# EAGLE design PowerLED_module (EAGLE 9.2.0)
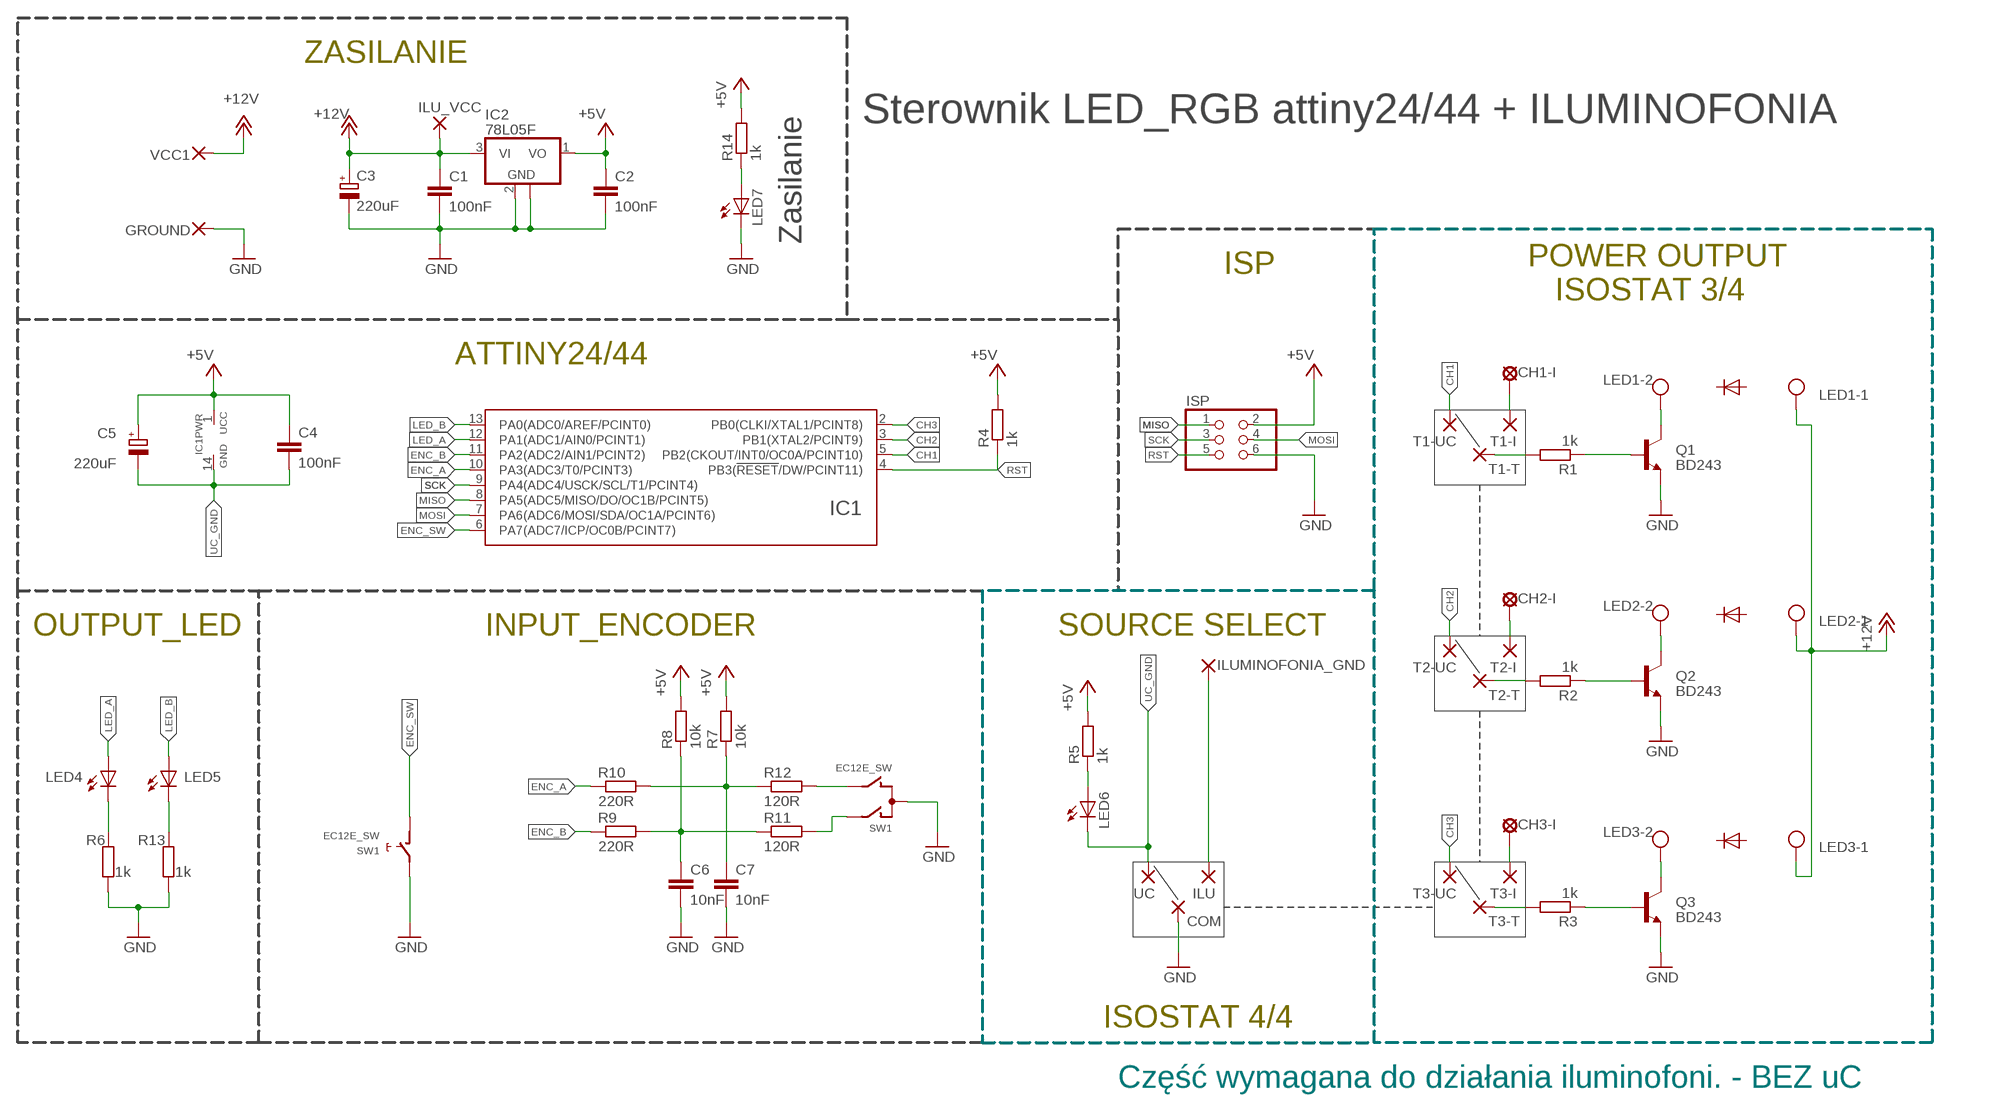
[diagram p0: schematic, sheet 1]

## Parts
C1  100nF  C-EU050-045-075  [C50-45-75]
C2  100nF  C-EU050-045-075  [C50-45-75]
C3  220uF  C-EU-POL'  [E2,5-6]
C4  100nF  C-EU050-045-075  [C50-45-75]
C5  220uF  C-EU-POL'  [E2,5-6]
C6  10nF  C-EU050-045-075  [C50-45-75]
C7  10nF  C-EU050-045-075  [C50-45-75]
CH1-I  SE14  [SE14]
CH2-I  SE14  [SE14]
CH3-I  SE14  [SE14]
COM  1,6/0,9  [1,6/0,9]
GROUND  3,81/1,4  [3,81/1,4]
IC1  ATTINY24/44/84-SSU  [SOIC14]
IC2  78L05F  [SOT89]
ILU  1,6/0,9  [1,6/0,9]
ILU_VCC  3,81/1,4  [3,81/1,4]
ILUMINOFONIA_GND  3,81/1,4  [3,81/1,4]
ISP  PINHD-2X3  [2X03]
LED1  AK300/2  [AK300/2]
LED2  AK300/2  [AK300/2]
LED3  AK300/2  [AK300/2]
LED4  LED5MM  [LED5MM]
LED5  LED5MM  [LED5MM]
LED6  LED5MM  [LED5MM]
LED7  LED5MM  [LED5MM]
Q1  BD243  [TO220]
Q2  BD243  [TO220]
Q3  BD243  [TO220]
R1  1k  R-EU7  [204/7]
R2  1k  R-EU7  [204/7]
R3  1k  R-EU7  [204/7]
R4  1k  R-EU_M1206  [M1206]
R5  1k  R-EU7  [204/7]
R6  1k  R-EU7  [204/7]
R7  10k  R-EU_M1206  [M1206]
R8  10k  R-EU_M1206  [M1206]
R9  220R  R-EU_M1206  [M1206]
R10  220R  R-EU_M1206  [M1206]
R11  120R  R-EU_M1206  [M1206]
R12  120R  R-EU_M1206  [M1206]
R13  1k  R-EU7  [204/7]
R14  1k  R-EU7  [204/7]
SW1  EC12E_SW  [ALPS_EC12E_SW]
T1-I  1,6/0,9  [1,6/0,9]
T1-T  1,6/0,9  [1,6/0,9]
T1-UC  1,6/0,9  [1,6/0,9]
T2-I  1,6/0,9  [1,6/0,9]
T2-T  1,6/0,9  [1,6/0,9]
T2-UC  1,6/0,9  [1,6/0,9]
T3-I  1,6/0,9  [1,6/0,9]
T3-T  1,6/0,9  [1,6/0,9]
T3-UC  1,6/0,9  [1,6/0,9]
UC  1,6/0,9  [1,6/0,9]
VCC1  3,81/1,4  [3,81/1,4]

## Nets
+5V: C2.P$1 C4.P$1 C5.P$1(+) IC1.1(UCC) IC2.1(VO) ISP.2 R4.2 R5.P$2 R7.2 R8.2 R14.P$2
+12V: C1.P$1 C3.P$1(+) IC2.3(VI) ILU_VCC.1(P) LED1.1 LED2.1 LED3.1 VCC1.1(P)
CH1: IC1.5(PB2(CKOUT/INT0/OC0A/PCINT10)) T1-UC.1(P)
CH2: IC1.3(PB1(XTAL2/PCINT9)) T2-UC.1(P)
CH3: IC1.2(PB0(CLKI/XTAL1/PCINT8)) T3-UC.1(P)
ENC_A: IC1.10(PA3(ADC3/T0/PCINT3)) R10.1
ENC_B: IC1.11(PA2(ADC2/AIN1/PCINT2)) R9.1
ENC_SW: IC1.6(PA7(ADC7/ICP/OC0B/PCINT7)) SW1.D
GND: C1.P$2 C2.P$2 C3.P$2(-) C6.P$2 C7.P$2 COM.1(P) GROUND.1(P) IC2.2(GND) IC2.2@1(GND) ISP.6 LED7.K(C) Q1.3(E) Q2.3(E) Q3.3(E) R6.P$1 R13.P$1 SW1.C SW1.E
ILU_GND: ILU.1(P) ILUMINOFONIA_GND.1(P)
LED_A: IC1.12(PA1(ADC1/AIN0/PCINT1)) LED4.A
LED_B: IC1.13(PA0(ADC0/AREF/PCINT0)) LED5.A
MISO: IC1.8(PA5(ADC5/MISO/DO/OC1B/PCINT5)) ISP.1
MOSI: IC1.7(PA6(ADC6/MOSI/SDA/OC1A/PCINT6)) ISP.4
N$1: LED1.2 Q1.2(C)
N$2: LED3.2 Q3.2(C)
N$3: LED2.2 Q2.2(C)
N$4: Q3.1(B) R3.P$1
N$5: R3.P$2 T3-T.1(P)
N$6: Q2.1(B) R2.P$1
N$7: R1.P$2 T1-T.1(P)
N$8: Q1.1(B) R1.P$1
N$9: R2.P$2 T2-T.1(P)
N$10: CH1-I.MP T1-I.1(P)
N$11: CH2-I.MP T2-I.1(P)
N$12: CH3-I.MP T3-I.1(P)
N$13: C7.P$1 R7.1 R10.2 R12.1
N$14: R12.2 SW1.B
N$15: R11.2 SW1.A
N$16: C6.P$1 R8.1 R9.2 R11.1
N$17: LED4.K(C) R6.P$2
N$18: LED5.K(C) R13.P$2
N$20: LED6.A R5.P$1
N$21: LED7.A R14.P$1
RST: IC1.4(PB3(!RESET!/DW/PCINT11)) ISP.5 R4.1
SCK: IC1.9(PA4(ADC4/USCK/SCL/T1/PCINT4)) ISP.3
UC_GND: C4.P$2 C5.P$2(-) IC1.14(GND) LED6.K(C) UC.1(P)
Unconnected: SW1.GND1(G) SW1.GND2(G)

## Notes on the sheet
- ZASILANIE
- Sterownik LED_RGB attiny24/44 + ILUMINOFONIA
- Zasilanie
- ISP
- POWER OUTPUT
       ISOSTAT 3/4
- ATTINY24/44
- OUTPUT_LED | INPUT_ENCODER | SOURCE SELECT
- ISOSTAT 4/4
- Część wymagana do działania iluminofoni. - BEZ uC

## Library data of the parts
C1 C2 C4 C6 C7 = RCL!:C-EU
C3 C5 = RCL!:C-EU-POL
CH1-I CH2-I CH3-I = solpad:SE14: SOLDER PAD E1553, drill 1,4mm, distributor Buerklin, 07F820
COM ILU T1-I T1-T T1-UC T2-I T2-T T2-UC T3-I T3-T T3-UC UC = wirepad:1,6/0,9: THROUGH-HOLE PAD
GROUND ILU_VCC ILUMINOFONIA_GND VCC1 = wirepad:3,81/1,4: THROUGH-HOLE PAD
IC1 = atmel_tiny24-44-84tiny48-88mega48-88-168-328:ATTINY24/44/84
IC2 = linear:78L*: POSITOIV-VOLTAGE REGULATORS Output up to 100 mA Source: Datasheet <http://focus.ti.com/lit/ds/symlink/ua78l05.pdf>
ISP = pinhead:PINHD-2X3: PIN HEADER
LED1-LED3 = con-ptr500:AK300/2: CONNECTOR; OC_FARNELL: unknown; OC_NEWARK: unknown
LED4-LED7 = led:LED: LED OSRAM: - CHIPLED LG R971, LG N971, LY N971, LG Q971, LY Q971, LO R971, LY R971 LH N974, LH R974 LS Q976, LO Q976, LY Q976 LO Q996 - Hyper CHIPLED LW Q18S LB Q993, LB Q99A, LB R99A - SideLED LS A670, LO A670, LY A670, LG A670, LP A670 LB A673, LV A673, LT A673, LW A673 LH A674 LY A675 LS A676, LA A676, LO A676, LY A676, LW A676 LS A679, LY A679, LG A679 - Hyper Micro SIDELED® LS Y876, LA Y876, LO Y876, LY Y876 LT Y87S - SmartLED LW L88C, LW L88S LB L89C, LB L89S, LG L890 LS L89K, LO L89K, LY L89K LS L896, LA L896, LO L896, LY L896 - TOPLED LS T670, LO T670, LY T670, LG T670, LP T670 LSG T670, LSP T670, LSY T670, LOP T670, LYG T670 LG T671, LOG T671, LSG T671 LB T673, LV T673, LT T673, LW T673 LH T674 LS T676, LA T676, LO T676, LY T676, LB T676, LH T676, LSB T676, LW T676 LB T67C, LV T67C, LT T67C, LS T67K, LO T67K, LY T67K, LW E67C LS E67B, LA E67B, LO E67B, LY E67B, LB E67C, LV E67C, LT E67C LW T67C LS T679, LY T679, LG T679 LS T770, LO T770, LY T770, LG T770, LP T770 LB T773, LV T773, LT T773, LW T773 LH T774 LS E675, LA E675, LY E675, LS T675 LS T776, LA T776, LO T776, LY T776, LB T776 LHGB T686 LT T68C, LB T68C - Hyper Mini TOPLED® LB M676 - Mini TOPLED Santana® LG M470 LS M47K, LO M47K, LY M47K Source: http://www.osram.convergy.de LUXEON: - LUMILED® LXK2-PW12-R00, LXK2-PW12-S00, LXK2-PW14-U00, LXK2-PW14-V00 LXK2-PM12-R00, LXK2-PM12-S00, LXK2-PM14-U00 LXK2-PE12-Q00, LXK2-PE12-R00, LXK2-PE12-S00, LXK2-PE14-T00, LXK2-PE14-U00 LXK2-PB12-K00, LXK2-PB12-L00, LXK2-PB12-M00, LXK2-PB14-N00, LXK2-PB14-P00, LXK2-PB14-Q00 LXK2-PR12-L00, LXK2-PR12-M00, LXK2-PR14-Q00, LXK2-PR14-R00 LXK2-PD12-Q00, LXK2-PD12-R00, LXK2-PD12-S00 LXK2-PH12-R00, LXK2-PH12-S00 LXK2-PL12-P00, LXK2-PL12-Q00, LXK2-PL12-R00 Source: www.luxeon.com KINGBRIGHT: KA-3528ASYC Source: www.kingbright.com
Q1-Q3 = transistor-npn:BD243*: NPN Transistor
R1-R3 R5 R6 R13 R14 = RCL!:R-EU
R4 R7-R12 = rcl:R-EU_: RESISTOR, European symbol; SPICEPREFIX: R
SW1 = switch-alps:EC12E_SW: ALPS rotary Encoder EC12E series with switch; MPN: EC12E2424407; OC_FARNELL: 1520813; OC_NEWARK: 74M1068

## Board
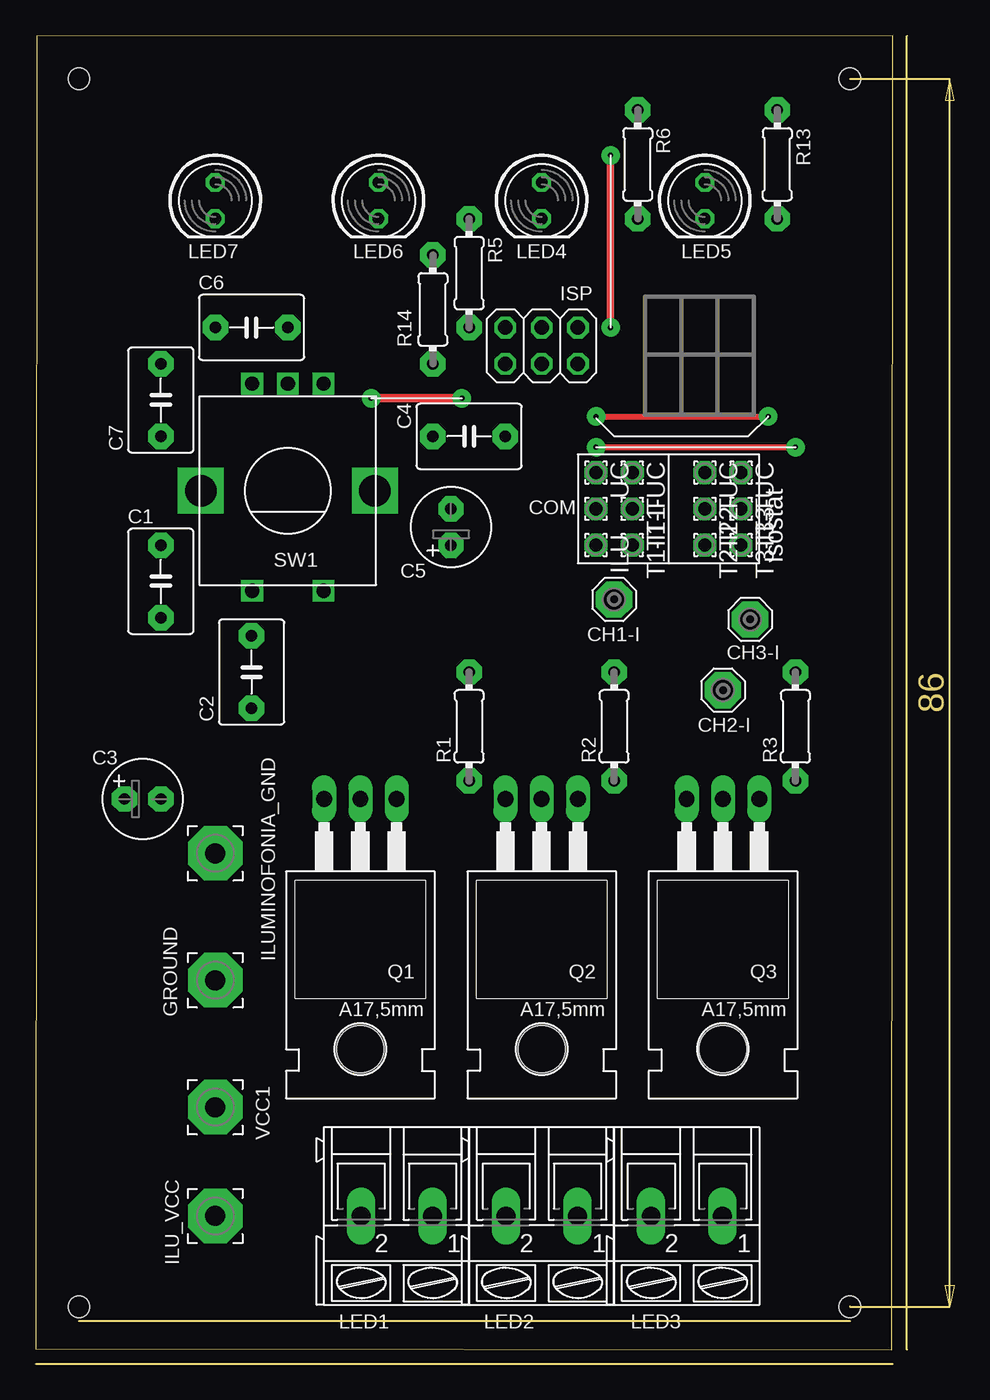
[diagram p1: board, top side]
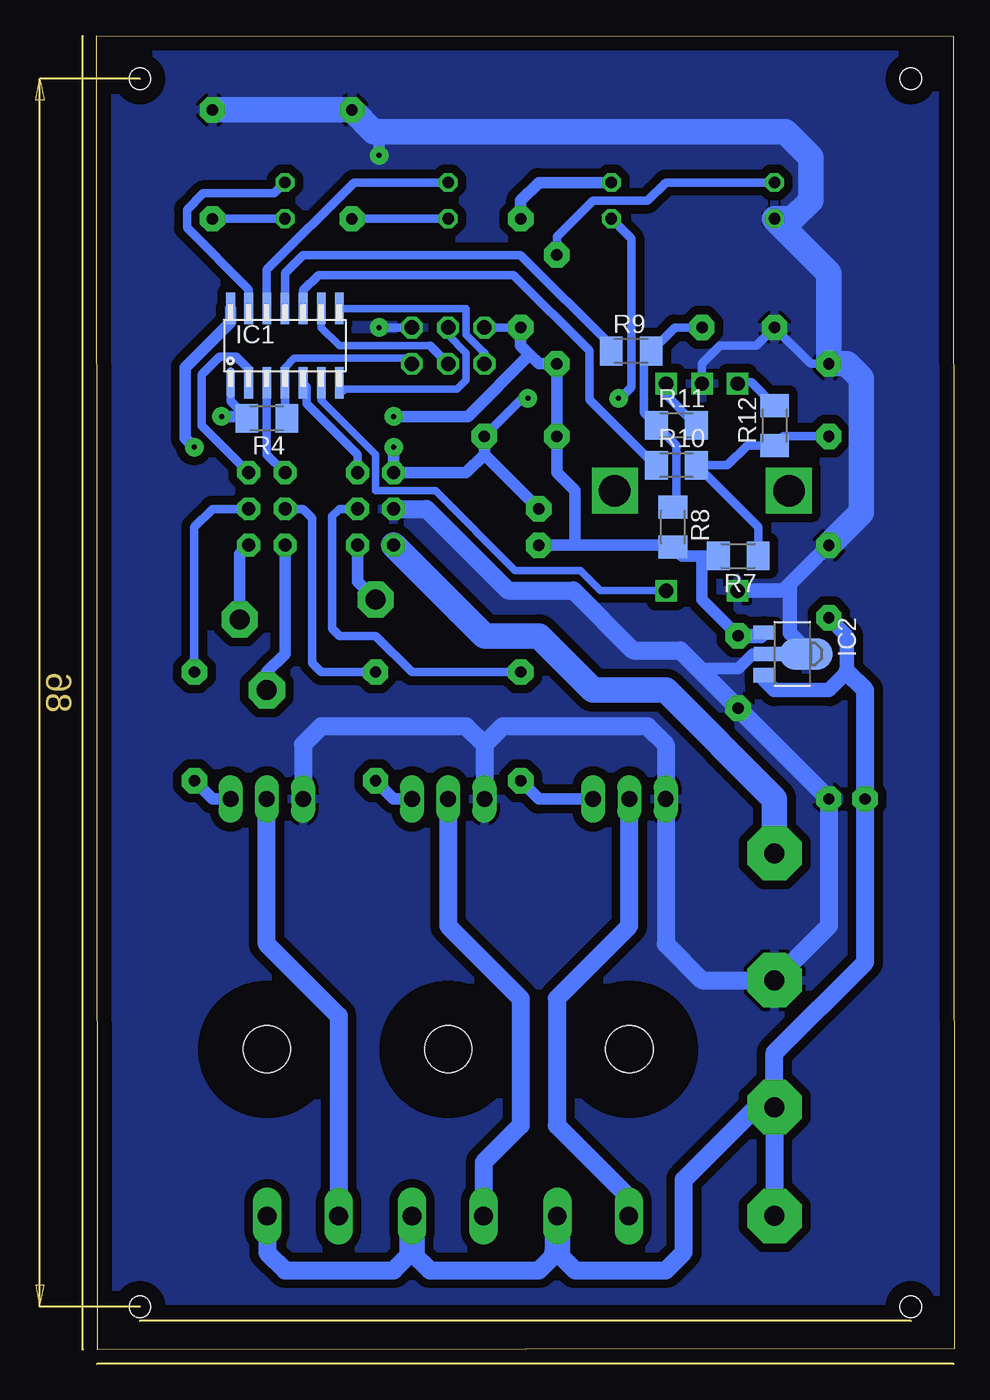
[diagram p2: board, bottom side, seen from below]

Size 60.04 x 92.03 mm. Coordinates in mm from the lower left corner, seen from the top.
Outline: 0,0.07 59.98,0 60.04,92.03 0.06,91.97 0,0.07
Copper layers (1*16): Top 0.035mm / dielectric 1.5mm / Bottom 0.035mm
Design rules "default": minimum track width 6mil, minimum drill 0.35mm, track to track 6mil, track to pad 6mil, pad to pad 6mil, via to via 6mil, smd to smd 6mil, copper to edge 40mil, drill to drill 6mil, minimum pad ring 10mil, minimum via ring 8mil, stop-mask expansion 4mil, vias tented up to drill 0mil, thermal gap 10mil
Holes 1.5 mm at 3.03,89.01 57.03,89.01 57.03,3.01 3.03,3.01

### Footprints (pad centres in the part's own frame; a part is rotated, then mirrored left to right if it is on the bottom)
C50-45-75 = drill 0.8 pad 1.778 octagon: P$1 -2.54,0; P$2 2.54,0
E2,5-6 = drill 0.8 pad 1.778 octagon: P$1 -1.27,0; P$2 1.27,0
SE14 = drill 1.397 pad 2.54 octagon: MP 0,0
1,6/0,9 = drill 0.914 pad 1.6 octagon: 1 0,0
3,81/1,4 = drill 1.397 pad 3.81 octagon: 1 0,0
SOIC14 = smd 0.61 x 2.21: 1 -3.81,-2.603; 2 -2.54,-2.603; 3 -1.27,-2.603; 4 0,-2.603; 5 1.27,-2.603; 6 2.54,-2.603; 7 3.81,-2.603; 8 3.81,2.603; 9 2.54,2.603; 10 1.27,2.603; 11 0,2.603; 12 -1.27,2.603; 13 -2.54,2.603; 14 -3.81,2.603
SOT89 = smd 1 x 1.5: 1 -1.499,-1.981; 3 1.499,-1.981 | smd 1 x 2: 2 0,-1.727 | smd 2.2 x 3.7: 2@1 0,0.94
2X03 = drill 1.016 octagon: 1 -2.54,-1.27; 2 -2.54,1.27; 3 0,-1.27; 4 0,1.27; 5 2.54,-1.27; 6 2.54,1.27
AK300/2 = drill 1.321 long: 1 -2.515,0; 2 2.489,0
LED5MM = drill 0.813 octagon: A -1.27,0; K 1.27,0
TO220 = drill 1.118 long: 1 -2.54,-6.35; 2 0,-6.35; 3 2.54,-6.35 | hole 3.302: 0,11.176
204/7 = drill 0.8 pad 1.778 octagon: P$1 -3.81,0; P$2 3.81,0
M1206 = smd 1.6 x 2: 1 -1.4,0; 2 1.4,0
ALPS_EC12E_SW = drill 1 square: A -2.5,-7.5; B 2.5,-7.5; C 0,-7.5; D -2.5,7; E 2.5,7 | drill 2.2 square: GND1 -6.1,0; GND2 6.1,0

### Placement (x,y rotation side)
C1  8.77,53.81 90 top
C2  15.12,47.46 270 top
C3  7.5,38.57 0 top
C4  30.36,63.97 0 top
C5  29.09,57.62 90 top
C6  15.12,71.59 180 top
C7  8.77,66.51 90 top
CH1-I  40.52,52.54 0 top
CH2-I  48.14,46.19 0 top
CH3-I  50.05,51.14 0 top
COM  39.25,58.89 270 top
GROUND  12.58,25.87 0 top
IC1  46.87,70.32 0 bottom
IC2  11.31,48.73 270 bottom
ILU  39.25,56.35 270 top
ILU_VCC  12.58,9.36 0 top
ILUMINOFONIA_GND  12.58,34.76 0 top
ISP  35.44,70.32 0 top
LED1  25.28,9.36 180 top
LED2  35.44,9.36 180 top
LED3  45.6,9.36 180 top
LED4  35.44,80.48 270 top
LED5  46.87,80.48 270 top
LED6  24.01,80.48 270 top
LED7  12.58,80.48 270 top
Q1  22.74,32.22 180 top
Q2  35.44,32.22 180 top
Q3  48.14,32.22 180 top
R1  30.36,43.65 90 top
R2  40.52,43.65 90 top
R3  53.22,43.65 90 top
R4  48.14,65.24 180 bottom
R5  30.36,75.4 270 top
R6  42.17,83.02 270 top
R7  15.12,55.59 180 bottom
R8  19.69,57.62 270 bottom
R9  22.61,69.94 0 bottom
R10  19.44,61.93 0 bottom
R11  19.44,64.73 0 bottom
R12  12.58,64.73 90 bottom
R13  51.95,83.02 270 top
R14  27.82,72.86 270 top
SW1  17.66,60.16 180 top
T1-I  41.79,56.35 270 top
T1-T  41.79,58.89 270 top
T1-UC  41.79,61.43 270 top
T2-I  46.87,56.35 270 top
T2-T  46.87,58.89 270 top
T2-UC  46.87,61.43 270 top
T3-I  49.41,56.35 270 top
T3-T  49.41,58.89 270 top
T3-UC  49.41,61.43 270 top
UC  39.25,61.43 270 top
VCC1  12.58,16.98 0 top

### Tracks (layer width: path | path; a pad name or v marks a point on that pad's centre or on a via)
+5V  (via drill 0.35 pad 1.3)
  Top 0.406: v39.25,65.36 v51.31,65.36
  Bottom 0.61: IC1.1 50.68,66.44 49.54,65.3 R4.2 | ISP.2 R5.P$2
  Bottom 0.813: C2.P$1 17.66,52.54 17.66,55.59 | 17.66,55.59 R7.2 | 17.66,55.59 19.06,55.59 R8.2 19.82,56.35 26.55,56.35 | 26.55,56.35 C5.P$1 | 26.55,56.35 26.55,60.16 27.82,61.43 C4.P$1 R14.P$2 29.09,69.05 29.72,69.68 | 29.72,69.68 30.36,70.32 R5.P$2 | v51.31,65.36 49.6,65.36 49.54,65.3 | v39.25,65.36 34.04,65.36 29.72,69.68
  Bottom 1.016: IC2.1 13.52,50 C2.P$1
+12V
  Bottom 1.016: C1.P$1 7.5,50 7.5,47.46 8.77,46.19 12.58,46.19 13.29,46.9 IC2.3
  Bottom 1.27: LED3.1 48.11,6.79 46.87,5.55 39.25,5.55 37.95,6.84 | LED2.1 37.95,6.79 36.71,5.55 29.09,5.55 27.82,6.82 26.55,5.55 20.2,5.55 18.93,6.82 18.93,11.9 13.85,16.98 VCC1.1 | VCC1.1 ILU_VCC.1 | VCC1.1 12.58,20.79 6.23,27.14 C3.P$1 6.23,46.19 7.5,47.46
  Bottom 1.778: 27.82,6.82 27.8,6.84 LED1.1 | 37.95,6.84 LED2.1
CH1
  Bottom 0.61: T1-UC.1 41.79,62.7 45.35,66.25 45.35,67.46 IC1.5
CH2
  Bottom 0.61: T2-UC.1 48.14,62.7 IC1.3
CH3
  Bottom 0.61: T3-UC.1 52.71,64.73 52.71,68.29 51.44,69.56 50.3,69.56 49.41,68.67 IC1.2
ENC_A
  Bottom 0.61: IC1.10 45.6,74.19 44.52,75.27 30.87,75.27 25.55,69.95 25.55,66.52 20.97,61.93 R10.1
ENC_B
  Bottom 0.61: IC1.11 46.87,75.4 45.6,76.67 30.36,76.67 24.01,70.32 R9.1
ENC_SW
  Bottom 0.508: IC1.6 44.33,66.51 40.52,62.7 40.52,60.16 36.33,60.16 30.74,54.57 26.17,54.57 24.76,53.16 SW1.D
GND  (via drill 0.35 pad 1.3)
  Top 0.508: v40.27,71.59 v40.27,83.65
  Bottom 0.254: IC2.2 IC2.2@1
  Bottom 0.61: 17.66,47.71 17.91,47.71 | SW1.C 17.66,69.05 16.39,70.32 13.85,70.32 C6.P$2 10.04,69.05 C7.P$2 | ISP.6 v40.27,71.59
  Bottom 0.813: IC2.2 14.1,48.73 15.12,47.71 17.66,47.71 | v40.27,83.65 40.27,84.92 40.65,85.3
  Bottom 1.016: C1.P$2 11.5,53.62 | 11.5,53.62 11.96,53.16 SW1.E | IC2.2@1 10.37,49.06 11.5,50.19 11.5,53.62
  Bottom 1.27: 32.9,42.38 31.63,43.65 21.47,43.65 20.2,42.38 Q1.3 20.2,28.41 17.66,25.87 GROUND.1 8.77,29.68 C3.P$2 C2.P$2 17.91,47.71 19.18,48.98 22.49,48.98 26.68,53.17 31.25,53.17 36.96,58.89 COM.1 | 32.9,42.38 Q2.3 | 32.9,42.38 34.17,43.65 44.33,43.65 45.6,42.38 Q3.3
  Bottom 1.778: C1.P$2 6.48,58.63 6.48,68.03 7.5,69.05 C7.P$2 8.77,75.4 LED7.K 11.31,79.21 10.04,80.48 10.04,83.53 11.82,85.3 40.65,85.3 R6.P$1 R13.P$1
  pour Bottom (isolate 0.61): -1.39,-0.8 60.84,-0.8 60.84,93.18 -1.39,93.18
ILU_GND
  Bottom 1.778: ILUMINOFONIA_GND.1 12.58,38.57 20.2,46.19 25.28,46.19 29.09,50 32.9,50 ILU.1
LED_A
  Bottom 0.61: LED4.A 42.04,81.75 48.14,75.65 IC1.12
LED_B
  Bottom 0.61: LED5.A 47.63,80.98 52.59,80.98 53.73,79.84 53.73,78.57 49.41,74.25 IC1.13
MISO
  Bottom 0.508: 32.9,69.81 34.17,71.08 34.17,72.92 IC1.8
  Bottom 0.61: ISP.1 32.9,69.81
MOSI
  Bottom 0.508: 35.44,71.08 34.17,69.81 34.17,67.9 34.81,67.27 42.68,67.27 42.81,67.14 43.06,67.4 IC1.7
  Bottom 0.61: ISP.4 35.44,71.08
N$1
  Bottom 1.27: LED1.2 22.74,9.41 22.74,10.63 27.82,15.71 27.82,24.6 22.74,29.68 Q1.2
N$2
  Bottom 1.27: Q3.2 48.14,28.41 43.11,23.38 LED3.2
N$3
  Bottom 1.27: Q2.2 35.44,29.68 30.36,24.6 30.36,15.71 32.95,13.12 LED2.2
N$4
  Bottom 0.813: Q3.1 51.95,38.57 R3.P$1
N$5
  Bottom 0.61: T3-T.1 51.95,58.89 53.22,57.62 R3.P$2
N$6
  Bottom 0.813: Q2.1 39.25,38.57 R2.P$1
N$7
  Bottom 0.61: T1-T.1 43.06,58.89 43.57,58.38 43.57,50.5 43.06,50 40.52,50 37.98,47.46 R1.P$2
N$8
  Bottom 0.813: Q1.1 29.09,38.57 R1.P$1
N$9
  Bottom 0.61: T2-T.1 45.6,58.89 44.97,58.25 44.97,48.09 44.33,47.46 R2.P$2
N$10
  Bottom 0.813: CH1-I.MP 41.79,53.81 T1-I.1
N$11
  Bottom 0.813: CH2-I.MP 48.14,47.46 46.87,48.73 T2-I.1
N$12
  Bottom 0.813: T3-I.1 50.05,55.71 CH3-I.MP
N$13
  Bottom 0.61: R7.1 13.72,57.62 R10.2 15.88,61.93 14.49,63.33 R12.1 11.94,63.97 C7.P$1
N$14
  Bottom 0.61: R12.2 14.2,67.75 15.25,67.75
  Bottom 1.016: 15.25,67.75 SW1.B
N$15
  Bottom 0.61: R11.2 20.16,66.85 SW1.A
N$16
  Bottom 0.61: C6.P$1 19.56,71.59 R9.2 21.72,69.43 21.72,65.61 R11.1 19.44,63.33 19.44,60.16 19.44,59.9 19.44,59.27 R8.1
N$17
  Bottom 0.61: R6.P$2 LED4.K
N$18
  Bottom 0.61: LED5.K R13.P$2
N$20
  Bottom 0.813: R5.P$1 30.36,80.48 29.09,81.75 LED6.A
N$21
  Bottom 0.61: LED7.A 20.2,81.75 21.47,80.48 25.28,80.48 27.82,77.94 R14.P$1
RST
  Bottom 0.508: 46.87,67.4 46.87,68.79 46.23,69.43 38.36,69.43
  Bottom 0.61: IC1.4 46.87,67.4 46.87,65.37 R4.1 | ISP.5 38.36,69.43
SCK
  Bottom 0.508: 36.71,70.32 43.06,70.32 44.33,71.59 IC1.9
  Bottom 0.61: 36.71,70.32 ISP.3
UC_GND  (via drill 0.35 pad 1.3)
  Top 0.406: v39.25,63.2 v53.22,63.2
  Top 0.61: v23.5,66.63 v29.85,66.63
  Bottom 0.61: LED6.K 22.61,77.81 22.61,67.4 23.38,66.63 v23.5,66.63 | v29.85,66.63 30.23,66.63 C4.P$2
  Bottom 0.813: C5.P$2 32.9,62.7 | 32.9,62.7 C4.P$2 | 32.9,62.7 34.17,61.43 UC.1 v39.25,63.2 | IC1.14 50.68,71.97 53.86,68.79 53.86,63.84 v53.22,63.2

### Text on the board
tNames: Isostat
tDocu: Sterownik LED RGB + Iluminofonia | Paweł Zięba / 12.10.2019 | +5V | MOSI | GND | * | MISO | SCK | RST | * | + | + | +